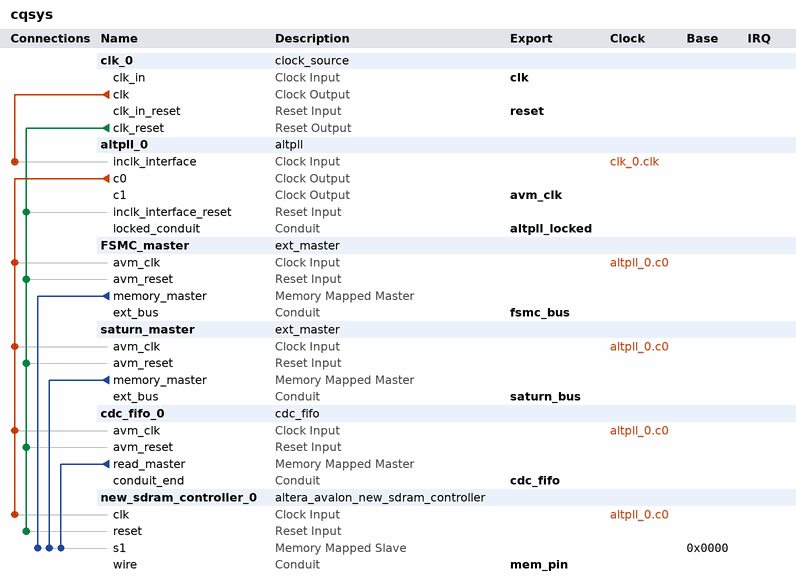
[diagram p0: system contents]
# Platform Designer (Qsys) system cqsys, Cyclone IV E EP4CE6F17C8
# Parameters at their usual value, and those the tool derives, are not listed.
package require -exact qsys 13.1
create_system cqsys
set_project_property DEVICE_FAMILY {Cyclone IV E}
set_project_property DEVICE EP4CE6F17C8

add_instance clk_0 clock_source 13.1
set_instance_parameter_value clk_0 clockFrequency 50000000

add_instance altpll_0 altpll 13.1
set_instance_parameter_value altpll_0 INCLK0_INPUT_FREQUENCY 20000
set_instance_parameter_value altpll_0 CLK0_MULTIPLY_BY 2
set_instance_parameter_value altpll_0 CLK1_MULTIPLY_BY 2
set_instance_parameter_value altpll_0 CLK0_DIVIDE_BY 1
set_instance_parameter_value altpll_0 CLK1_DIVIDE_BY 1
set_instance_parameter_value altpll_0 CLK1_PHASE_SHIFT 0
set_instance_parameter_value altpll_0 CLK1_DUTY_CYCLE 50
set_instance_parameter_value altpll_0 PORT_clk1 PORT_USED
set_instance_parameter_value altpll_0 PORT_clk2 PORT_UNUSED
set_instance_parameter_value altpll_0 PORT_clk3 PORT_UNUSED
set_instance_parameter_value altpll_0 PORT_ARESET PORT_UNUSED
set_instance_parameter_value altpll_0 PORT_LOCKED PORT_USED

add_instance FSMC_master ext_master 1.0

add_instance saturn_master ext_master 1.0

add_instance cdc_fifo_0 cdc_fifo 1.0

add_instance new_sdram_controller_0 altera_avalon_new_sdram_controller 13.1
set_instance_parameter_value new_sdram_controller_0 TAC 6.0
set_instance_parameter_value new_sdram_controller_0 TRCD 20.0
set_instance_parameter_value new_sdram_controller_0 TRP 20.0
set_instance_parameter_value new_sdram_controller_0 TWR 20.0
set_instance_parameter_value new_sdram_controller_0 casLatency 2
set_instance_parameter_value new_sdram_controller_0 columnWidth 9
set_instance_parameter_value new_sdram_controller_0 dataWidth 16
set_instance_parameter_value new_sdram_controller_0 generateSimulationModel false
set_instance_parameter_value new_sdram_controller_0 initRefreshCommands 8
set_instance_parameter_value new_sdram_controller_0 model single_Micron_MT48LC4M32B2_7_chip
set_instance_parameter_value new_sdram_controller_0 numberOfBanks 4
set_instance_parameter_value new_sdram_controller_0 numberOfChipSelects 1
set_instance_parameter_value new_sdram_controller_0 powerUpDelay 200.0
set_instance_parameter_value new_sdram_controller_0 refreshPeriod 31.25
set_instance_parameter_value new_sdram_controller_0 rowWidth 13
set_instance_parameter_value new_sdram_controller_0 TMRD 2

# connections
add_connection altpll_0.c0 cdc_fifo_0.avm_clk clock
add_connection altpll_0.c0 FSMC_master.avm_clk clock
add_connection altpll_0.c0 new_sdram_controller_0.clk clock
add_connection altpll_0.c0 saturn_master.avm_clk clock
add_connection clk_0.clk altpll_0.inclk_interface clock
add_connection clk_0.clk_reset altpll_0.inclk_interface_reset reset
add_connection clk_0.clk_reset cdc_fifo_0.avm_reset reset
add_connection clk_0.clk_reset FSMC_master.avm_reset reset
add_connection clk_0.clk_reset new_sdram_controller_0.reset reset
add_connection clk_0.clk_reset saturn_master.avm_reset reset
add_connection cdc_fifo_0.read_master new_sdram_controller_0.s1 avalon
set_connection_parameter_value cdc_fifo_0.read_master/new_sdram_controller_0.s1 baseAddress 0x0000
add_connection FSMC_master.memory_master new_sdram_controller_0.s1 avalon
set_connection_parameter_value FSMC_master.memory_master/new_sdram_controller_0.s1 baseAddress 0x0000
add_connection saturn_master.memory_master new_sdram_controller_0.s1 avalon
set_connection_parameter_value saturn_master.memory_master/new_sdram_controller_0.s1 baseAddress 0x0000

# exported interfaces
add_interface clk clock sink
set_interface_property clk EXPORT_OF clk_0.clk_in
add_interface reset reset sink
set_interface_property reset EXPORT_OF clk_0.clk_in_reset
add_interface mem_pin conduit end
set_interface_property mem_pin EXPORT_OF new_sdram_controller_0.wire
add_interface altpll_locked conduit end
set_interface_property altpll_locked EXPORT_OF altpll_0.locked_conduit
add_interface avm_clk clock source
set_interface_property avm_clk EXPORT_OF altpll_0.c1
add_interface saturn_bus conduit end
set_interface_property saturn_bus EXPORT_OF saturn_master.ext_bus
add_interface fsmc_bus conduit end
set_interface_property fsmc_bus EXPORT_OF FSMC_master.ext_bus
add_interface cdc_fifo conduit end
set_interface_property cdc_fifo EXPORT_OF cdc_fifo_0.conduit_end

set_interconnect_requirement {$system} qsys_mm.clockCrossingAdapter HANDSHAKE
set_interconnect_requirement {$system} qsys_mm.maxAdditionalLatency 1

save_system cqsys.qsys
